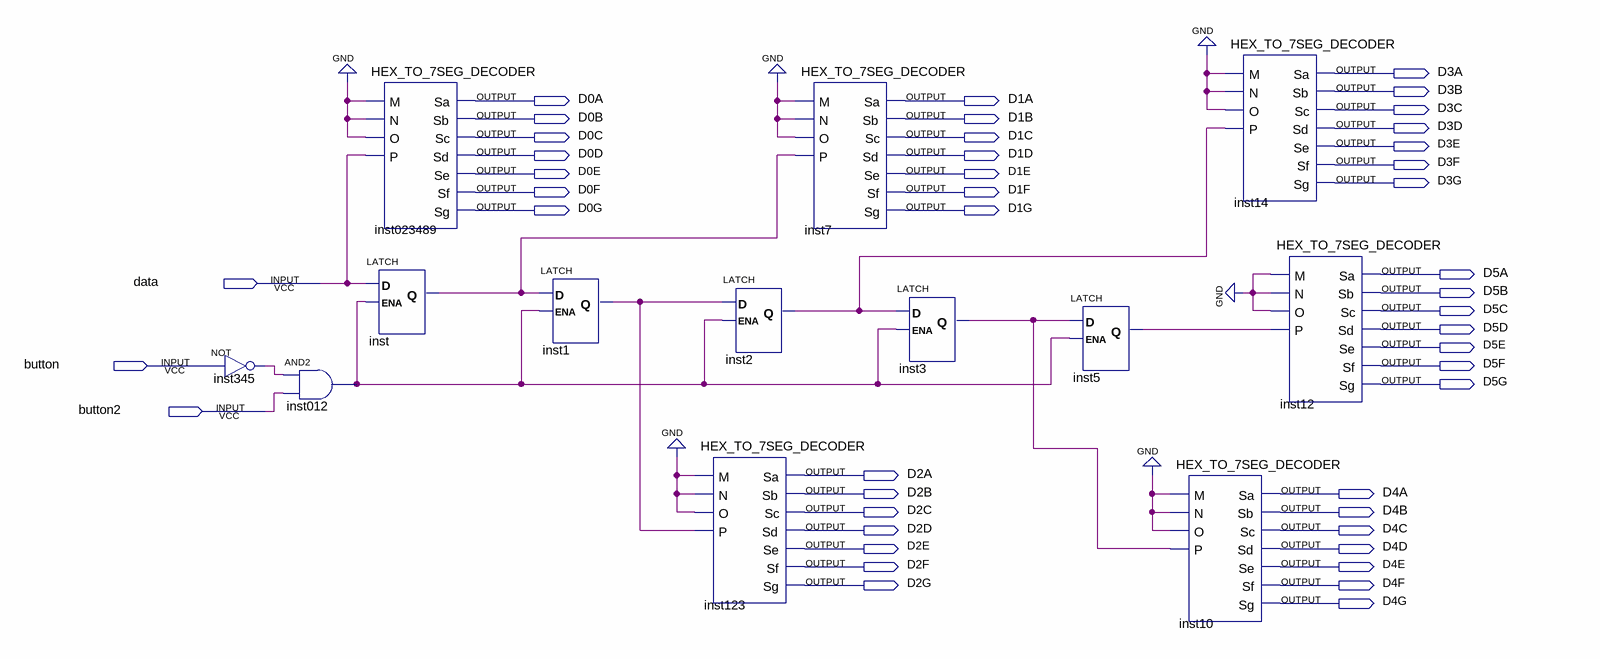
[diagram p0: schematic sheet]
// Quartus schematic Registrador.bdf as structural Verilog: 13 symbols, 45 pins
module Registrador (
  input  data,
  input  button,
  input  button2,
  output D3A,
  output D3B,
  output D0A,
  output D1A,
  output D3C,
  output D0B,
  output D1B,
  output D3D,
  output D0C,
  output D1C,
  output D3E,
  output D0D,
  output D1D,
  output D3F,
  output D0E,
  output D1E,
  output D3G,
  output D0F,
  output D1F,
  output D0G,
  output D1G,
  output D5A,
  output D5B,
  output D5C,
  output D5D,
  output D5E,
  output D5F,
  output D5G,
  output D2A,
  output D2B,
  output D4A,
  output D2C,
  output D4B,
  output D2D,
  output D4C,
  output D2E,
  output D4D,
  output D2F,
  output D4E,
  output D2G,
  output D4F,
  output D4G
);

  wire inst1_q, inst2_q, inst3_q, inst5_q, inst012_out, inst345_out, inst_q;

  not inst345 (inst345_out, button);
  and inst012 (inst012_out, inst345_out, button2);
  HEX_TO_7SEG_DECODER inst023489 (
    .M(1'b0), .N(1'b0), .O(1'b0), .P(data), .Sa(D0A), .Sb(D0B), .Sc(D0C), .Sd(D0D), .Se(D0E), .Sf(D0F),
    .Sg(D0G));
  LATCH inst (.D(data), .ENA(inst012_out), .Q(inst_q));
  LATCH inst1 (.D(inst_q), .ENA(inst012_out), .Q(inst1_q));
  LATCH inst2 (.D(inst1_q), .ENA(inst012_out), .Q(inst2_q));
  HEX_TO_7SEG_DECODER inst123 (
    .M(1'b0), .N(1'b0), .O(1'b0), .P(inst1_q), .Sa(D2A), .Sb(D2B), .Sc(D2C), .Sd(D2D), .Se(D2E), .Sf(D2F),
    .Sg(D2G));
  HEX_TO_7SEG_DECODER inst7 (
    .M(1'b0), .N(1'b0), .O(1'b0), .P(inst_q), .Sa(D1A), .Sb(D1B), .Sc(D1C), .Sd(D1D), .Se(D1E), .Sf(D1F),
    .Sg(D1G));
  LATCH inst3 (.D(inst2_q), .ENA(inst012_out), .Q(inst3_q));
  LATCH inst5 (.D(inst3_q), .ENA(inst012_out), .Q(inst5_q));
  HEX_TO_7SEG_DECODER inst10 (
    .M(1'b0), .N(1'b0), .O(1'b0), .P(inst3_q), .Sa(D4A), .Sb(D4B), .Sc(D4C), .Sd(D4D), .Se(D4E), .Sf(D4F),
    .Sg(D4G));
  HEX_TO_7SEG_DECODER inst14 (
    .M(1'b0), .N(1'b0), .O(1'b0), .P(inst2_q), .Sa(D3A), .Sb(D3B), .Sc(D3C), .Sd(D3D), .Se(D3E), .Sf(D3F),
    .Sg(D3G));
  HEX_TO_7SEG_DECODER inst12 (
    .M(1'b0), .N(1'b0), .O(1'b0), .P(inst5_q), .Sa(D5A), .Sb(D5B), .Sc(D5C), .Sd(D5D), .Se(D5E), .Sf(D5F),
    .Sg(D5G));
endmodule
